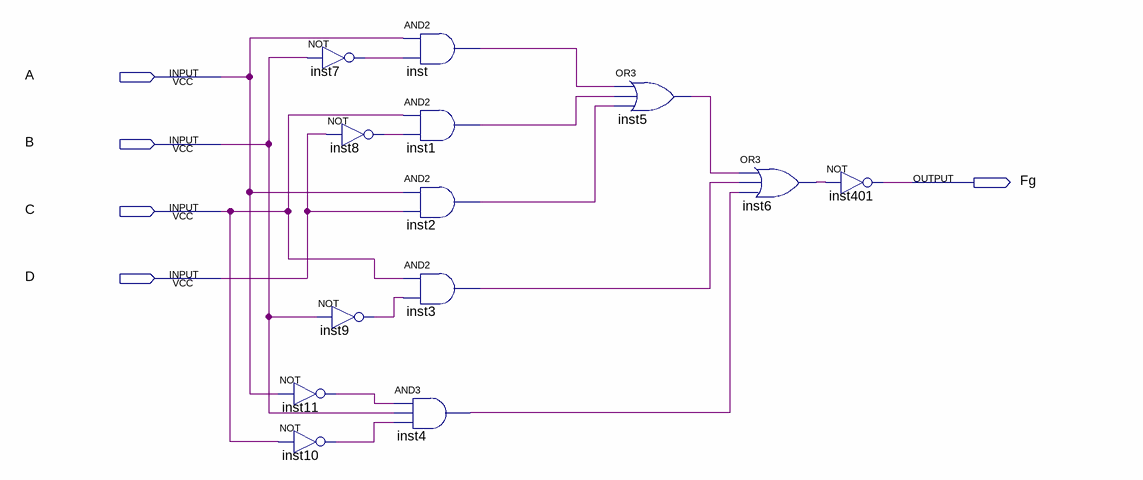
[diagram p0: schematic sheet]
// Quartus schematic fg.bdf as structural Verilog: 13 symbols, 5 pins
module fg (
  input  A,
  input  B,
  input  C,
  input  D,
  output Fg
);

  wire inst1_out, inst2_out, inst3_out, inst4_out, inst5_out, inst6_out, inst7_out, inst8_out, inst9_out,
       inst10_out, inst11_out, inst_out;

  not inst11 (inst11_out, A);
  not inst10 (inst10_out, C);
  not inst7 (inst7_out, B);
  not inst8 (inst8_out, D);
  not inst9 (inst9_out, B);
  and inst (inst_out, A, inst7_out);
  and inst1 (inst1_out, C, inst8_out);
  and inst2 (inst2_out, A, D);
  and inst3 (inst3_out, C, inst9_out);
  and inst4 (inst4_out, inst11_out, B, inst10_out);
  or inst5 (inst5_out, inst_out, inst1_out, inst2_out);
  or inst6 (inst6_out, inst5_out, inst3_out, inst4_out);
  not inst401 (Fg, inst6_out);
endmodule
